# Altium project Pi-Zero_HUB.X4.PrjPcb
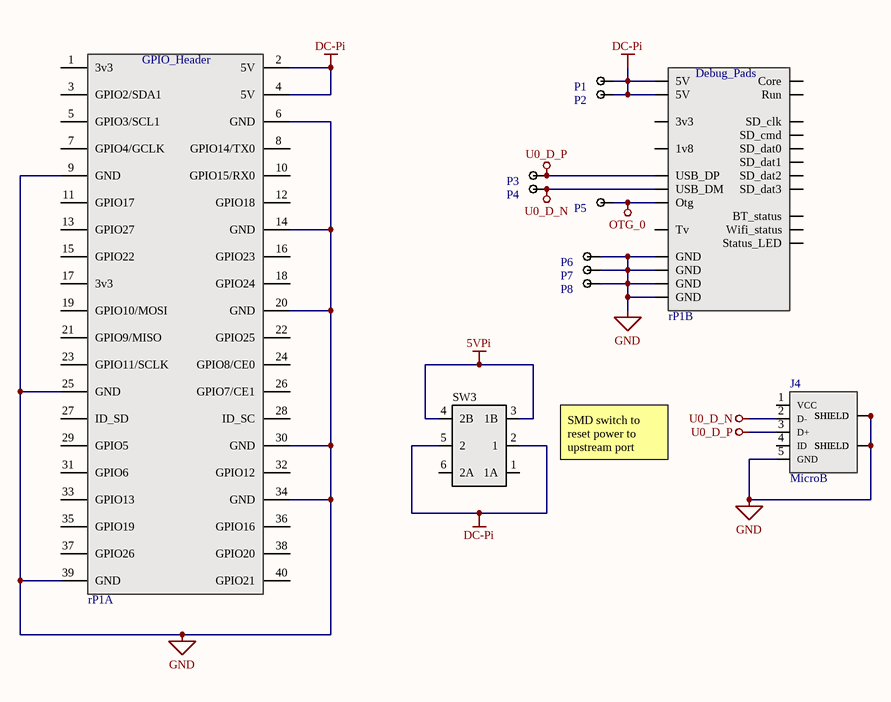
[diagram p0: RPi_Carrier.SchDoc]
4 sheets, 128 parts. Net scope: global (net labels, ports and power ports of the same name join across sheets).
Board file: Pi-Zero_HUB.PcbDoc
Sheets:
  RPi_Carrier.SchDoc
  Power Regulation.SchDoc
  USB Hub.SchDoc
  LAN_RJ45.SchDoc

## Sheet RPi_Carrier.SchDoc
size A; SPICEModelCacheFYOWLMMU: <root> / <DocumentId>FYOWLMMU</DocumentId> / </root>; SheetNumber: 1; SheetTotal: 4; CompanyName: Gamber-Johnson LLC; Organization: CD Cell

### Parts
J4  MicroB  [10118194-0001LF]
P1  MillMax Pogo  [0914-1-15-20-77-14-11-0]  (value not drawn)
P2  MillMax Pogo  [0914-1-15-20-77-14-11-0]  (value not drawn)
P3  MillMax Pogo  [0914-1-15-20-77-14-11-0]  (value not drawn)
P4  MillMax Pogo  [0914-1-15-20-77-14-11-0]  (value not drawn)
P5  MillMax Pogo  [0914-1-15-20-77-14-11-0]  (value not drawn)
P6  MillMax Pogo  [0914-1-15-20-77-14-11-0]  (value not drawn)
P7  MillMax Pogo  [0914-1-15-20-77-14-11-0]  (value not drawn)
P8  MillMax Pogo  [0914-1-15-20-77-14-11-0]  (value not drawn)
rP1  rPi Zero Carrier  [rPiZero]  (value not drawn)  (parts A,B of 2)
SW3  (no value)  [SMD-DPDT-SW]

### Nets
5VPi: SW3.3(1B) SW3.4(2B)
DC-Pi: P1.1 P2.1 rP1.2(5V) rP1.4(5V) rP1.5V1(5V) rP1.5V2(5V) SW3.2(1) SW3.5(2)
GND: J4.5(GND) J4.SH1(SHIELD) J4.SH2(SHIELD) J4.SH3(SHIELD) J4.SH4(SHIELD) J4.SH5(SHIELD) J4.SH6(SHIELD) P6.1 P7.1 P8.1 rP1.6(GND) rP1.9(GND) rP1.14(GND) rP1.20(GND) rP1.25(GND) rP1.30(GND) rP1.34(GND) rP1.39(GND) rP1.G1(GND) rP1.G2(GND) rP1.G3(GND) rP1.G4(GND)
OTG_0: P5.1 rP1.OTG(Otg)
U0_D_N: J4.2(D-) P4.1 rP1.USB_DM
U0_D_P: J4.3(D+) P3.1 rP1.USB_DP

Not connected (* = marked no-connect by the designer): J4 1(VCC) 4(ID); rP1 1(3v3) 1V8(1v8) 3(GPIO2/SDA1) 3V3(3v3) 5(GPIO3/SCL1) 7(GPIO4/GCLK) 8(GPIO14/TX0) 10(GPIO15/RX0) 11(GPIO17) 12(GPIO18) 13(GPIO27) 15(GPIO22) 16(GPIO23) 17(3v3) 18(GPIO24) 19(GPIO10/MOSI) 21(GPIO9/MISO) 22(GPIO25) 23(GPIO11/SCLK) 24(GPIO8/CE0) 26(GPIO7/CE1) 27(ID_SD) 28(ID_SC) 29(GPIO5) 31(GPIO6) 32(GPIO12) 33(GPIO13) 35(GPIO19) 36(GPIO16) 37(GPIO26) 38(GPIO20) 40(GPIO21) BT_ON(BT_status) CORE(Core) RUN(Run) SD_CLK(SD_clk) SD_CMD(SD_cmd) SD_DAT0(SD_dat0) SD_DAT1(SD_dat1) SD_DAT2(SD_dat2) SD_DAT3(SD_dat3) STATUS(Status_LED) TV(Tv) WL_ON(Wifi_status); SW3 1(1A) 6(2A)

### Notes on the sheet
- SMD switch to reset power to upstream port
- REV
- REVISIONS
- DATE
- DESCRIPTION
- BY
- UNLESS OTHERWISE SPECIFIED, DRAWING DEFINITIONS AND TOLERANCES SHALL BE FOUND UNDER SUPPLIER STANDARDS SS-001. THIS PART AND ALL COMPONENTS OF IT MUST BE RoHS & REACH COMPLIANT. A CERTIFICATE OF COMPLIANCE MUST BE PROVIDED UPON REQUEST.
- ALL INFORMATION ON THIS DOCUMENT IS THE SOLE PROPERTY OF GAMBER-JOHNSON AND SHALL NOT BE COPIED, REPRODUCED, USED OR DISCLOSED IN WHOLE OR IN PART WITHOUT THE WRITTEN CONSENT OF GAMBER-JOHNSON
- TOLERANCES
  .00 ± .060
  .000 ± .020
  .0000 ± .005
  ANGELS ± 1°
- DRAWN BY:
- PROJECT NUMBER:
- SHEET TITLE:
- SHEET
- OF
- DATE:
- LOCATION:
- ASSEMBLY NUMBER
- SIZE
- GAMBER-JOHNSON LLC
  5001 Joerns Dr
  STEVENS POINT, WI 54481
  +1 (715) 344-5209
- A
- (in symbol RP-Zero, part A) GPIO_Header
- (in symbol RP-Zero, part B) Debug_Pads

### Library data of the parts
J4 = 10118194-0001LF: Micro USB, Input Output Connectors, B TYPE RECEPTACLE with flange; MF: Amphenol ICC; SnapEDA_Link: https://www.snapeda.com/parts/10118194-0001LF/Amphenol+FCI/view-part/?ref=snap; Package: None; Value: *; MP: 10118194-0001LF; Check_prices: https://www.snapeda.com/parts/10118194-0001LF/Amphenol+FCI/view-part/?ref=eda; LCSC PN: C132563
P1-P8 = GenericPogo: MillMax Pogo Pins/Probes
rP1 = RP-Zero: Raspberry Pi Zero/W/2W / Header, debug-pads, & mounting
SW3 = MS-22D17-G2: Brick nogging DPDT Black SMD Slide Switch; LCSC PN: C2904912

## Sheet Power Regulation.SchDoc
size A; SheetNumber: 2; SheetTotal: 4
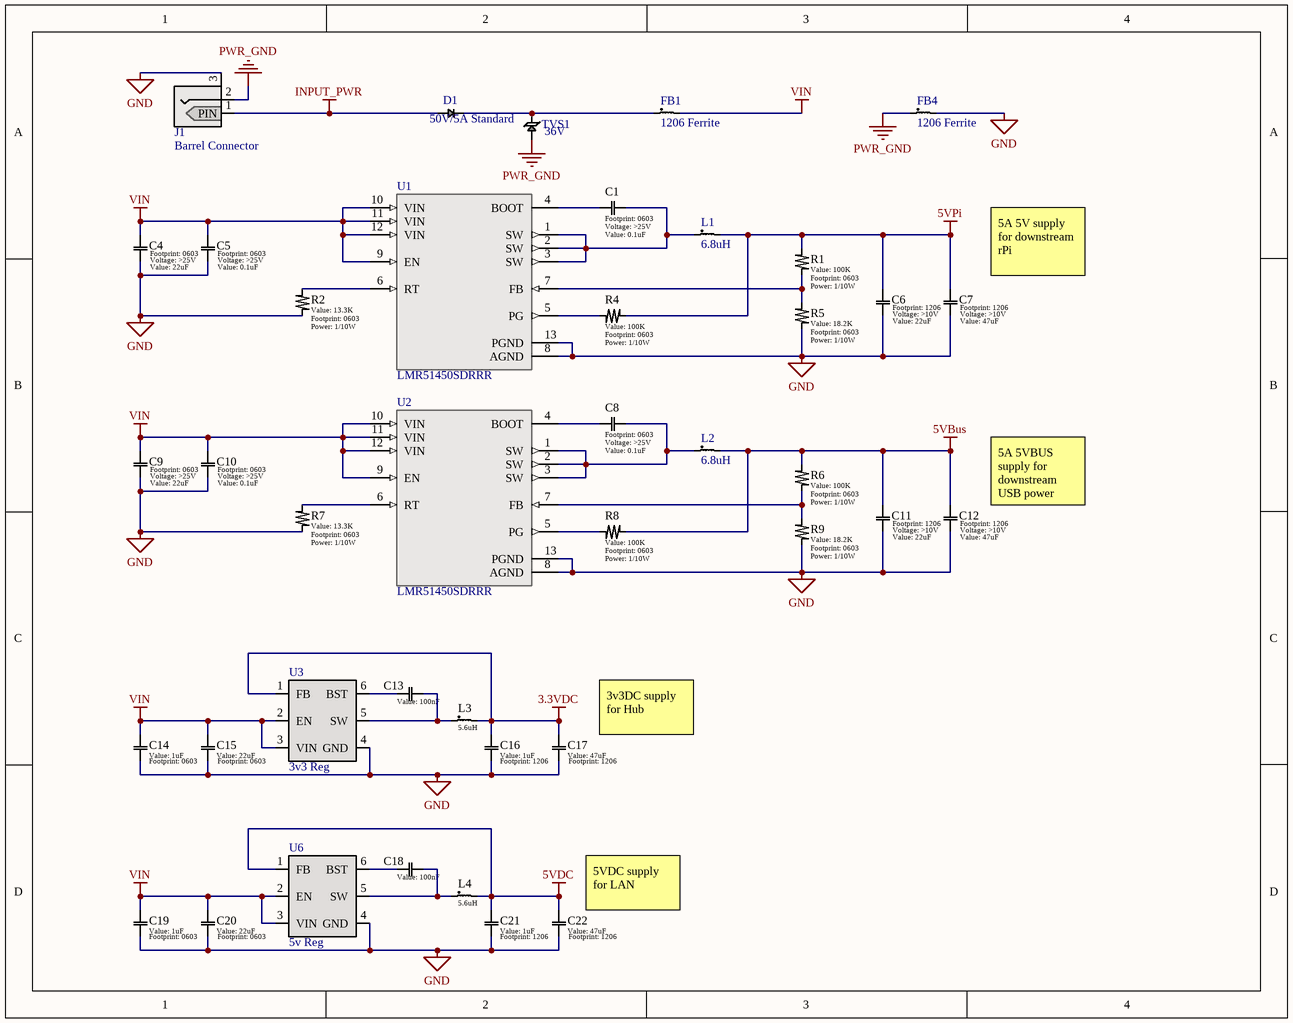
[diagram p1: Power Regulation.SchDoc]

### Parts
C1  value 0.1uF  Voltage: >25V  [0603]  (hidden comment: Generic Capacitor)
C4  value 22uF  Voltage: >25V  [0603]  (hidden comment: Generic Capacitor)
C5  value 0.1uF  Voltage: >25V  [0603]  (hidden comment: Generic Capacitor)
C6  value 22uF  Voltage: >10V  [1206]  (hidden comment: Generic Capacitor)
C7  value 47uF  Voltage: >10V  [1206]  (hidden comment: Generic Capacitor)
C8  value 0.1uF  Voltage: >25V  [0603]  (hidden comment: Generic Capacitor)
C9  value 22uF  Voltage: >25V  [0603]  (hidden comment: Generic Capacitor)
C10  value 0.1uF  Voltage: >25V  [0603]  (hidden comment: Generic Capacitor)
C11  value 22uF  Voltage: >10V  [1206]  (hidden comment: Generic Capacitor)
C12  value 47uF  Voltage: >10V  [1206]  (hidden comment: Generic Capacitor)
C13  value 100nF  [0603]  (hidden comment: Generic Capacitor)
C14  value 1uF  [0603]  (hidden comment: Generic Capacitor)
C15  value 22uF  [0603]  (hidden comment: Generic Capacitor)
C16  value 1uF  [1206]  (hidden comment: Generic Capacitor)
C17  value 47uF  [1206]  (hidden comment: Generic Capacitor)
C18  value 100nF  [0603]  (hidden comment: Generic Capacitor)
C19  value 1uF  [0603]  (hidden comment: Generic Capacitor)
C20  value 22uF  [0603]  (hidden comment: Generic Capacitor)
C21  value 1uF  [1206]  (hidden comment: Generic Capacitor)
C22  value 47uF  [1206]  (hidden comment: Generic Capacitor)
D1  50V/5A Standard  [DO-214AC]
FB1  1206 Ferrite  [1206]
FB4  1206 Ferrite  [1206]
J1  Barrel Connector  [PJ-082BH]
L1  6.8uH  [IHLP3232DZER6R8M11]
L2  6.8uH  [IHLP3232DZER6R8M11]
L3  5.6uH  [TMPC0402HP]
L4  5.6uH  [TMPC0402HP]
R1  value 100K  Power: 1/10W  [0603]  (hidden comment: Generic Resistor)
R2  value 13.3K  Power: 1/10W  [0603]  (hidden comment: Generic Resistor)
R4  value 100K  Power: 1/10W  [0603]  (hidden comment: Generic Resistor)
R5  value 18.2K  Power: 1/10W  [0603]  (hidden comment: Generic Resistor)
R6  value 100K  Power: 1/10W  [0603]  (hidden comment: Generic Resistor)
R7  value 13.3K  Power: 1/10W  [0603]  (hidden comment: Generic Resistor)
R8  value 100K  Power: 1/10W  [0603]  (hidden comment: Generic Resistor)
R9  value 18.2K  Power: 1/10W  [0603]  (hidden comment: Generic Resistor)
TVS1  36V  [DO-214AC]
U1  LMR51450SDRRR  [WSON-12]
U2  LMR51450SDRRR  [WSON-12]
U3  3v3 Reg  [TSOT-23-6]
U6  5v Reg  [TSOT-23-6]

### Nets
3.3VDC: C16.1 C17.1 L3.2 U3.1(FB)
5VBus: C11.1 C12.1 L2.2 R6.2 R8.1
5VDC: C21.1 C22.1 L4.2 U6.1(FB)
5VPi: C6.1 C7.1 L1.2 R1.2 R4.1
GND: C4.2 C5.2 C6.2 C7.2 C9.2 C10.2 C11.2 C12.2 C14.2 C15.2 C16.2 C17.2 C19.2 C20.2 C21.2 C22.2 FB4.2 J1.3(SHD_B) R2.1 R5.1 R7.1 R9.1 U1.8(AGND) U1.13(PGND) U2.8(AGND) U2.13(PGND) U3.4(GND) U6.4(GND)
INPUT_PWR: D1.2(Anode) J1.1(PIN)
PWR_GND: FB4.1 J1.2(SHD_A) TVS1.2(Anode)
VIN: C4.1 C5.1 C9.1 C10.1 C14.1 C15.1 C19.1 C20.1 FB1.2 U1.9(EN) U1.10(VIN) U1.11(VIN) U1.12(VIN) U2.9(EN) U2.10(VIN) U2.11(VIN) U2.12(VIN) U3.2(EN) U3.3(VIN) U6.2(EN) U6.3(VIN)
NetC1_1: C1.1 U1.4(BOOT)
NetC1_2: C1.2 L1.1 U1.1(SW) U1.2(SW) U1.3(SW)
NetC8_1: C8.1 U2.4(BOOT)
NetC8_2: C8.2 L2.1 U2.1(SW) U2.2(SW) U2.3(SW)
NetC13_1: C13.1 U3.6(BST)
NetC13_2: C13.2 L3.1 U3.5(SW)
NetC18_1: C18.1 U6.6(BST)
NetC18_2: C18.2 L4.1 U6.5(SW)
NetD1_1: D1.1(Cathode) FB1.1 TVS1.1(Cathode)
NetR1_1: R1.1 R5.2 U1.7(FB)
NetR2_2: R2.2 U1.6(RT)
NetR4_2: R4.2 U1.5(PG)
NetR6_1: R6.1 R9.2 U2.7(FB)
NetR7_2: R7.2 U2.6(RT)
NetR8_2: R8.2 U2.5(PG)

### Notes on the sheet
- (near C7) 5A 5V supply for downstream rPi
- (near C12) 5A 5VBUS supply for downstream USB power
- (near C17) 3v3DC supply for Hub
- (near C22) 5VDC supply for LAN
- REV
- REVISIONS
- DATE
- DESCRIPTION
- BY
- UNLESS OTHERWISE SPECIFIED, DRAWING DEFINITIONS AND TOLERANCES SHALL BE FOUND UNDER SUPPLIER STANDARDS SS-001. THIS PART AND ALL COMPONENTS OF IT MUST BE RoHS & REACH COMPLIANT. A CERTIFICATE OF COMPLIANCE MUST BE PROVIDED UPON REQUEST.
- ALL INFORMATION ON THIS DOCUMENT IS THE SOLE PROPERTY OF GAMBER-JOHNSON AND SHALL NOT BE COPIED, REPRODUCED, USED OR DISCLOSED IN WHOLE OR IN PART WITHOUT THE WRITTEN CONSENT OF GAMBER-JOHNSON
- TOLERANCES
  .00 ± .060
  .000 ± .020
  .0000 ± .005
  ANGELS ± 1°
- DRAWN BY:
- PROJECT NUMBER:
- SHEET TITLE:
- SHEET
- OF
- DATE:
- LOCATION:
- ASSEMBLY NUMBER
- SIZE
- GAMBER-JOHNSON LLC
  5001 Joerns Dr
  STEVENS POINT, WI 54481
  +1 (715) 344-5209
- A

### Library data of the parts
C1 C4 C5 C7-C10 C12 = Generic Capacitor: Tolerance: 10%
C6 C11 = Generic Capacitor: Tolerance: 20%
C13-C22 = Generic Capacitor: Voltage: >10V; Tolerance: 10%
D1 = SBRT5A50SA-13: Diode Super Barrier 50V 5A Surface Mount; Manufacturer 1: Diodes; Element Configuration: Single; Forward Voltage: 460mV; Max Forward Surge Current (Ifsm): 70A; Max Reverse Current: 45mA; Supplier 1: Digi-Key; Manufacturer Part Number 1: SBRT5A50SA-13; RoHS: Yes; Category: Rectifier Diodes; Stock 1: 218992; Pricing 1: 1=0.49000, 10=0.38200, 100=0.22900, 500=0.21200, 1000=0.14416, 2000=0.13271 (USD); Mount: Surface Mount; Case/Package: SMA; Weight: 0.002258oz; Min Operating Temperature: -55°C; Max Operating Temperature: 150°C; Packaging: Tape and Reel; Average Rectified Current: 5A; Max Repetitive Reverse Voltage (Vrrm): 50V; Package Quantity: 5000; Max Reverse Voltage (DC): 50V; Lead Free: Lead Free; RoHS Compliant: Yes; ComponentLink1URL: http://www.farnell.com/datasheets/2814462.pdf?src-supplier=Farnell; ComponentLink1Description: http://www.farnell.com/datasheets/2814462.pdf?src-supplier=Farnell; ComponentLink2URL: https://www.diodes.com/assets/Datasheets/SBRT5A50SA.pdf?src-supplier=Arrow+Electronics; ComponentLink2Description: https://www.diodes.com/assets/Datasheets/SBRT5A50SA.pdf?src-supplier=Arrow+Electronics; ComponentLink3URL: https://www.diodes.com/assets/Datasheets/SBRT5A50SA.pdf?src-supplier=Mouser; ComponentLink3Description: https://www.diodes.com/assets/Datasheets/SBRT5A50SA.pdf?src-supplier=Mouser; ComponentLink4URL: https://www.diodes.com/assets/Datasheets/SBRT5A50SA.pdf?src-supplier=Avnet+Europe; ComponentLink4Description: https://www.diodes.com/assets/Datasheets/SBRT5A50SA.pdf?src-supplier=Avnet+Europe; ComponentLink5URL: http://www.farnell.com/datasheets/2814462.pdf?src-supplier=Newark; ComponentLink5Description: http://www.farnell.com/datasheets/2814462.pdf?src-supplier=Newark; ComponentLink6URL: https://www.diodes.com/assets/Datasheets/SBRT5A50SA.pdf?src-supplier=Avnet; ComponentLink6Description: https://www.diodes.com/assets/Datasheets/SBRT5A50SA.pdf?src-supplier=Avnet; ComponentLink7URL: https://www.diodes.com/assets/Datasheets/SBRT5A50SA.pdf?src-supplier=Digi-Key; ComponentLink7Description: https://www.diodes.com/assets/Datasheets/SBRT5A50SA.pdf?src-supplier=Digi-Key; ComponentLink8URL: http://www.farnell.com/datasheets/2814462.pdf?src-supplier=Element14; ComponentLink8Description: http://www.farnell.com/datasheets/2814462.pdf?src-supplier=Element14; ComponentLink9URL: https://www.diodes.com/assets/Datasheets/SBRT5A50SA.pdf?src-supplier=Verical; ComponentLink9Description: https://www.diodes.com/assets/Datasheets/SBRT5A50SA.pdf?src-supplier=Verical; Supplier Part Number 1: SBRT5A50SA-13DICT-ND
FB1 FB4 = HI1206T161R-10: 160 Ohms @ 100MHz 1 Power, Signal Line Ferrite Bead 1206 (3216 Metric) 6A 18mOhm; Manufacturer 1: Laird Steward; DC Resistance (DCR): 18mR; Number of Lines: 1; Impedance: 160R; Supplier 1: Digi-Key; Manufacturer Part Number 1: HI1206T161R-10; RoHS: Yes; Category: Fixed Inductors; Stock 1: 250713; Pricing 1: 1=0.20000, 10=0.15600, 25=0.12920, 50=0.11140, 100=0.10020, 250=0.08464, 500=0.07572, 1000=0.06458 (USD); Mount: Surface Mount; Case/Package: 1206; Weight: 0.0136oz; Case Code (Metric): 3216; Case Code (Imperial): 1206; Core Material: Ferrite; Material: Ferrite; Min Operating Temperature: -40°C; Max Operating Temperature: 125°C; Package Quantity: 1; Packaging: Tape and Reel; Max Current Rating: 6A; Current Rating: 6A; Max DC Current: 6A; Termination: SMD/SMT; Frequency: 100MHz; Test Frequency: 100MHz; Length: 3.2mm; Height: 0.071inch; Width: 0.063inch; Depth: 1.8mm; Lead Free: Lead Free; REACH SVHC: Unknown; ComponentLink1URL: https://datasheet.ciiva.com/22622/1685743-22622771.pdf?src-supplier=Element14; ComponentLink1Description: https://datasheet.ciiva.com/22622/1685743-22622771.pdf?src-supplier=Element14; ComponentLink2URL: https://datasheet.ciiva.com/16714/70065439-16714326.pdf?src-supplier=Allied+Electronics; ComponentLink2Description: https://datasheet.ciiva.com/16714/70065439-16714326.pdf?src-supplier=Allied+Electronics; Supplier Part Number 1: 240-2411-1-ND; LCSC PN: C391193
J1 = PJ-082BH: CONN PWR JACK 2.5X5.5MM SOLDER; Manufacturer 1: CUI; Gender: Male; Shielding: Shielded; Current Rating: 10A; Number of Conductors: 2; Supplier 1: Digi-Key; Manufacturer Part Number 1: PJ-082BH; RoHS: Yes; Category: Connectors; Stock 1: 24371; Pricing 1: 1=1.69000, 10=1.53600, 25=1.44200, 50=1.37940, 100=1.31670 (USD); Mount: Through Hole; Color: Black; Contact Material: Brass; Housing Material: Nylon; Contact Plating: Silver; Housing Color: Black; Min Operating Temperature: -25°C; Max Operating Temperature: 85°C; Orientation: Horizontal; Connector Type: Jack; Termination: Solder; Lead Free: Lead Free; ComponentLink1URL: https://datasheet.ciiva.com/7368/pj-082bh-7368042.pdf?src-supplier=Digi-Key; ComponentLink1Description: https://datasheet.ciiva.com/7368/pj-082bh-7368042.pdf?src-supplier=Digi-Key; ComponentLink2URL: https://datasheet.ciiva.com/7368/pj-082bh-7368045.pdf?src-supplier=Digi-Key; ComponentLink2Description: https://datasheet.ciiva.com/7368/pj-082bh-7368045.pdf?src-supplier=Digi-Key; Supplier Part Number 1: CP-082BHCT-ND; LCSC PN: C3001296
L1 L2 = IHLP3232DZER6R8M11: FIXED IND 6.8UH 7A 33.4 MOHM SMD; Manufacturer 1: Vishay Dale; Core Material: Ferrite; Inductance Tolerance: 20%; Self Resonant Frequency: 13MHz; Shielding: Shielded; Saturation Current: 6.7A; DC Resistance (DCR): 33.4mR; Test Frequency: 100kHz; LCSC PN: C511015; Supplier 1: Digi-Key; Manufacturer Part Number 1: IHLP3232DZER6R8M11; RoHS: Yes; Category: Fixed Inductors; Stock 1: 9946; Pricing 1: 1=1.40000, 10=1.30000, 25=1.20000, 50=1.00000, 100=0.94000, 250=0.84000 (USD); Mount: Surface Mount; Case/Package: 3232; Number of Pins: 2; Min Operating Temperature: -55°C; Max Operating Temperature: 125°C; Package Quantity: 500; Packaging: Tape and Reel; Tolerance: 20%; Current Rating: 7A; Inductance: 6.8uH; Max DC Current: 6.7A; Termination: SMD/SMT; RMS Current (Irms): 7A; Series: IHLP-3232DZ-11; Rated Current-Max: 7A; Length: 0.34inch; Width: 8.18mm; Height: 4mm; Height - Seated (Max): 0.157inch; Depth: 8.26mm; Radiation Hardening: No; REACH SVHC: Unknown; Military Standard: Not; Lead Free: Lead Free; RoHS Compliant: Yes; ComponentLink1URL: https://datasheet.ciiva.com/5763/ihlp3232dz11-5763504.pdf?src-supplier=Farnell; ComponentLink1Description: https://datasheet.ciiva.com/5763/ihlp3232dz11-5763504.pdf?src-supplier=Farnell; ComponentLink2URL: https://datasheet.ciiva.com/1058/ihlp-3232dz-11-1058078.pdf?src-supplier=Digi-Key; ComponentLink2Description: https://datasheet.ciiva.com/1058/ihlp-3232dz-11-1058078.pdf?src-supplier=Digi-Key; ComponentLink3URL: https://datasheet.ciiva.com/1058/ihlp-3232dz-11-1058079.pdf?src-supplier=Digi-Key; ComponentLink3Description: https://datasheet.ciiva.com/1058/ihlp-3232dz-11-1058079.pdf?src-supplier=Digi-Key; ComponentLink4URL: https://datasheet.ciiva.com/1058/ihlp-3232dz-11-1058077.pdf?src-supplier=Digi-Key; ComponentLink4Description: https://datasheet.ciiva.com/1058/ihlp-3232dz-11-1058077.pdf?src-supplier=Digi-Key; ComponentLink5URL: https://datasheet.ciiva.com/8495/ihlp3232dz11-8495151.pdf?src-supplier=Avnet; ComponentLink5Description: https://datasheet.ciiva.com/8495/ihlp3232dz11-8495151.pdf?src-supplier=Avnet; ComponentLink6URL: https://datasheet.ciiva.com/8017/ihlp3232dz11-8017326.pdf?src-supplier=Element14; ComponentLink6Description: https://datasheet.ciiva.com/8017/ihlp3232dz11-8017326.pdf?src-supplier=Element14; Supplier Part Number 1: 541-1355-1-ND
L3 L4 = TMPC0402HP-5R6MG-Z02: 2A 5.6uH ±20% SMD Power Inductor; LCSC PN: C357137; Supplier 1: Digi-Key; Supplier Part Number 1: 732-3339-1-ND
R1 R2 R4-R9 = Generic Resistor: Tolerance: 1%
TVS1 = SMAJ36A: 58.1V Clamp 6.9A Ipp Tvs Diode Surface Mount DO-214AC (SMA); Manufacturer 1: Littelfuse; Peak Pulse Power: 400W; Polarity: Unidirectional; Breakdown Voltage: 40V; Test Current: 1mA; Number of Channels: 1; Leakage Current: 1uA; Max Power Dissipation: 3.3W; Power Line Protection: No; Max Breakdown Voltage: 44.2V; Supplier 1: Digi-Key; Manufacturer Part Number 1: SMAJ36A; RoHS: Yes; Category: TVS Diodes; Stock 1: 65200; Pricing 1: 1=0.41000, 10=0.27500, 100=0.15750, 500=0.11000, 1000=0.08750, 2000=0.08500 (USD); Mount: Surface Mount; Number of Pins: 2; Min Operating Temperature: -65°C; Max Operating Temperature: 150°C; Clamping Voltage: 58.1V; Packaging: Tape and Reel; Reverse Standoff Voltage: 36V; Peak Pulse Current: 6.9A; Max Surge Current: 6.9A; Package Quantity: 5000; Operating Supply Voltage: 36V; Reverse Breakdown Voltage: 40V; Min Breakdown Voltage: 40V; Number of Elements: 1; Termination: SMD/SMT; Direction: Unidirectional; Resistor Type: Zener; Number of Unidirectional Channels: 1; Voltage Rating (DC): 36V; Power Dissipation: 400W; Length: 5.28mm; Height: 2.29mm; Width: 2.79mm; Lead Free: Lead Free; REACH SVHC: No SVHC; ComponentLink1URL: https://datasheet.ciiva.com/330/littelfuse-tvs-diode-smaj-datasheet-pdf-330760.pdf?src-supplier=Digi-Key; ComponentLink1Description: https://datasheet.ciiva.com/330/littelfuse-tvs-diode-smaj-datasheet-pdf-330760.pdf?src-supplier=Digi-Key; ComponentLink2URL: https://datasheet.ciiva.com/330/littelfuse-tvs-diode-smaj-datasheet-pdf-330762.pdf?src-supplier=Digi-Key; ComponentLink2Description: https://datasheet.ciiva.com/330/littelfuse-tvs-diode-smaj-datasheet-pdf-330762.pdf?src-supplier=Digi-Key; ComponentLink3URL: https://datasheet.ciiva.com/28473/607617-28473423.pdf?src-supplier=Element14; ComponentLink3Description: https://datasheet.ciiva.com/28473/607617-28473423.pdf?src-supplier=Element14; ComponentLink4URL: https://datasheet.ciiva.com/330/littelfuse-tvs-diode-smaj-datasheet-pdf-330761.pdf?src-supplier=Digi-Key; ComponentLink4Description: https://datasheet.ciiva.com/330/littelfuse-tvs-diode-smaj-datasheet-pdf-330761.pdf?src-supplier=Digi-Key; ComponentLink5URL: https://datasheet.ciiva.com/16487/littelfuse-tvs-diode-smaj-16487437.pdf?src-supplier=Future+Electronics; ComponentLink5Description: https://datasheet.ciiva.com/16487/littelfuse-tvs-diode-smaj-16487437.pdf?src-supplier=Future+Electronics; Supplier Part Number 1: SMAJ36ALFCT-ND
U1 U2 = LMR51450SDRRR: 36-V, 5-A synchronous buck converter; MF: Texas Instruments; SnapEDA_Link: https://www.snapeda.com/parts/LMR51450SDRRR/Texas+Instruments/view-part/?ref=snap; Package: WSON-12 Texas Instruments; Value: *; MP: LMR51450SDRRR; Check_prices: https://www.snapeda.com/parts/LMR51450SDRRR/Texas+Instruments/view-part/?ref=eda; LCSC PN: C6890985
U3 = AP63203WU-7: Switching Voltage Regulators DCDC Conv HV Buck TSOT26 T&R 3K; Manufacturer_Name: Diodes Inc.; Geometry.Height: 1mm; Manufacturer_Part_Number: AP63203WU-7; Mouser Part Number: 621-AP63203WU-7; Mouser Price/Stock: https://www.mouser.co.uk/ProductDetail/Diodes-Incorporated/AP63203WU-7?qs=u16ybLDytRZ1JqxbuLkMJw%3D%3D; Arrow Part Number: AP63203WU-7; Arrow Price/Stock: https://www.arrow.com/en/products/ap63203wu-7/diodes-incorporated?region=asia; Datasheet Link: https://componentsearchengine.com/Datasheets/1/AP63203WU-7.pdf; LCSC PN: C780769
U6 = AP63205WU-7: Step-down type Fixed 2A 5V 3.8V~32V; Mfr_Name: Diodes Inc; Copyright: Copyright (C) 2023 Ultra Librarian. All rights reserved.; Manufacturer_Part_Number: AP63205WU-7; RefDes: RefDes; Type: DEV; LCSC PN: C2071056

## Sheet USB Hub.SchDoc
size A; SheetNumber: 3; SheetTotal: 4; CompanyName: Gamber-Johnson LLC; Organization: CD Cell
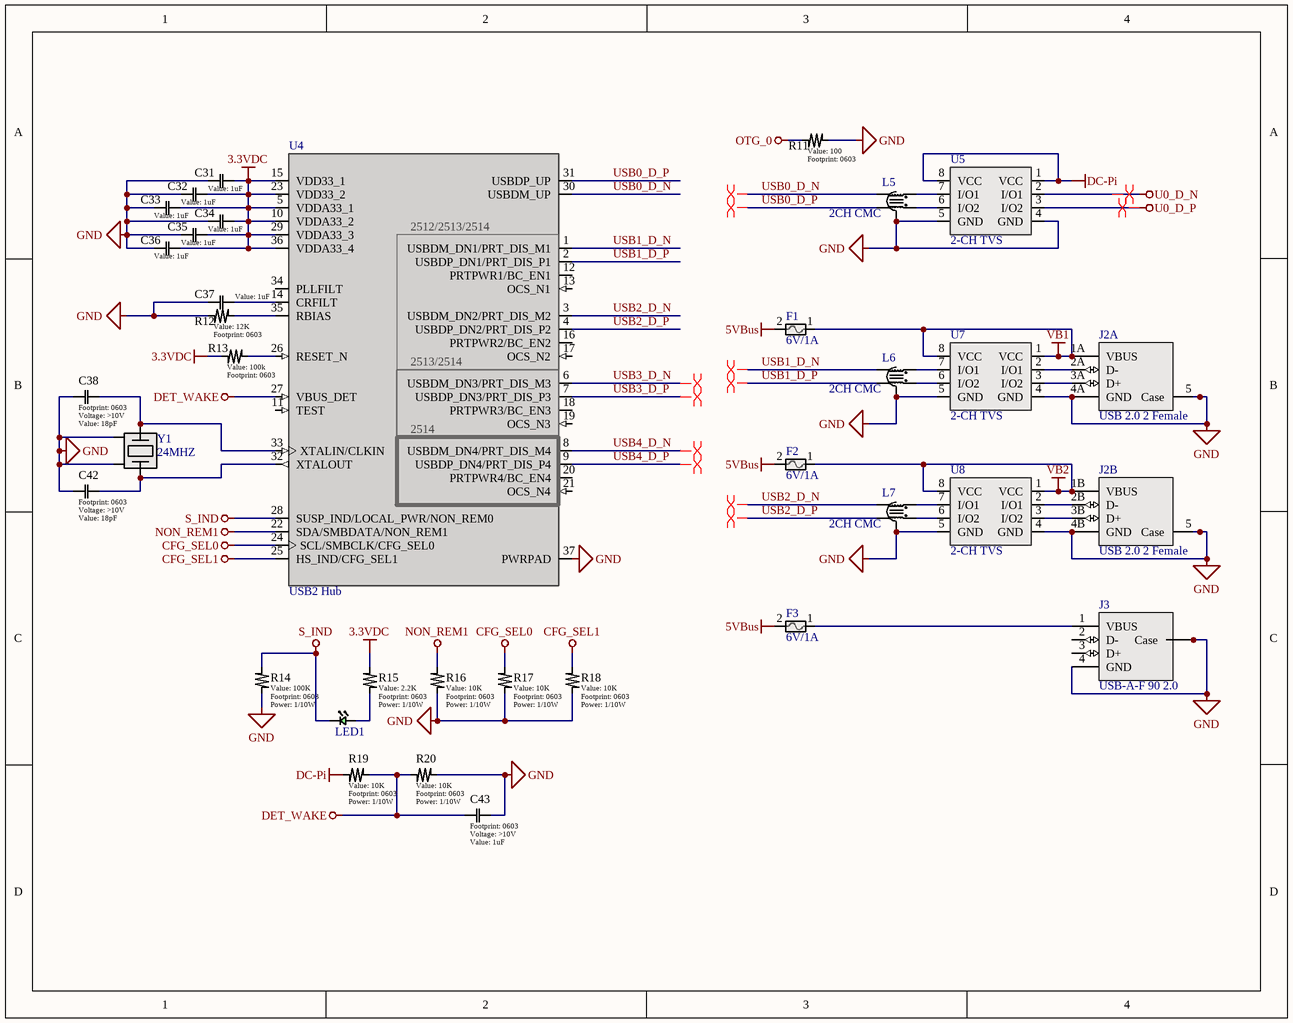
[diagram p2: USB Hub.SchDoc]

### Parts
C31  value 1uF  [0603]  (hidden comment: Generic Capacitor)
C32  value 1uF  [0603]  (hidden comment: Generic Capacitor)
C33  value 1uF  [0603]  (hidden comment: Generic Capacitor)
C34  value 1uF  [0603]  (hidden comment: Generic Capacitor)
C35  value 1uF  [0603]  (hidden comment: Generic Capacitor)
C36  value 1uF  [0603]  (hidden comment: Generic Capacitor)
C37  value 1uF  [0603]  (hidden comment: Generic Capacitor)
C38  value 18pF  Voltage: >10V  [0603]  (hidden comment: Generic Capacitor)
C42  value 18pF  Voltage: >10V  [0603]  (hidden comment: Generic Capacitor)
C43  value 1uF  Voltage: >10V  [0603]  (hidden comment: Generic Capacitor)
F1  6V/1A  [0805]
F2  6V/1A  [0805]
F3  6V/1A  [0805]
J2  USB 2.0 2 Female  [907-111A1022D10200]  (parts A,B of 2)
J3  USB-A-F 90 2.0  [Molex_67329-8000]
L5  2CH CMC  [SMD-6-2CH]
L6  2CH CMC  [SMD-6-2CH]
L7  2CH CMC  [SMD-6-2CH]
LED1  LTST-C191KGKT  [0603 (1608 Metric) Concave]  (value not drawn)
R11  value 100  [0603]  (hidden comment: Generic Resistor)
R12  value 12K  [0603]  (hidden comment: Generic Resistor)
R13  value 100k  [0603]  (hidden comment: Generic Resistor)
R14  value 100K  Power: 1/10W  [0603]  (hidden comment: Generic Resistor)
R15  value 2.2K  Power: 1/10W  [0603]  (hidden comment: Generic Resistor)
R16  value 10K  Power: 1/10W  [0603]  (hidden comment: Generic Resistor)
R17  value 10K  Power: 1/10W  [0603]  (hidden comment: Generic Resistor)
R18  value 10K  Power: 1/10W  [0603]  (hidden comment: Generic Resistor)
R19  value 10K  Power: 1/10W  [0603]  (hidden comment: Generic Resistor)
R20  value 10K  Power: 1/10W  [0603]  (hidden comment: Generic Resistor)
U4  USB2 Hub  [36-QFN (6x6)]
U5  2-CH TVS  [8-SOIC]
U7  2-CH TVS  [8-SOIC]
U8  2-CH TVS  [8-SOIC]
Y1  24MHZ  [SMD2520-4P]

### Nets
3.3VDC: C31.2 C32.2 C33.2 C34.2 C35.2 C36.2 R13.1 R15.1 U4.5(VDDA33_1) U4.10(VDDA33_2) U4.15(VDD33_1) U4.23(VDD33_2) U4.29(VDDA33_3) U4.36(VDDA33_4)
5VBus: F1.2 F2.2 F3.2
CFG_SEL0: R17.1 U4.24(SCL/SMBCLK/CFG_SEL0)
CFG_SEL1: R18.1 U4.25(HS_IND/CFG_SEL1)
DC-Pi: R19.1 U5.1(VCC) U5.8(VCC)
DET_WAKE: C43.1 R19.2 R20.1 U4.27(VBUS_DET)
GND: C31.1 C32.1 C33.1 C34.1 C35.1 C36.1 C37.1 C38.1 C42.1 C43.2 J2.4A(GND) J2.4B(GND) J2.5(Case) J3.4(GND) J3.5(Case) J3.6(Case) J3.7(Case) J3.8(Case) L5.5 L5.6 L6.5 L6.6 L7.5 L7.6 R11.2 R12.1 R14.2 R16.2 R17.2 R18.2 R20.2 U4.37(PWRPAD) U5.4(GND) U5.5(GND) U7.4(GND) U7.5(GND) U8.4(GND) U8.5(GND) Y1.2(GND) Y1.4(GND)
NON_REM1: R16.1 U4.22(SDA/SMBDATA/NON_REM1)
OTG_0: R11.1
S_IND: LED1.1(Cathode) R14.1 U4.28(SUSP_IND/LOCAL_PWR/NON_REM0)
U0_D_N: U5.2(I/O1)
U0_D_P: U5.3(I/O2)
VB1: F1.1 J2.1A(VBUS) U7.1(VCC) U7.8(VCC)
VB2: F2.1 J2.1B(VBUS) U8.1(VCC) U8.8(VCC)
USB0_D_N: L5.4 U4.30(USBDM_UP)
USB0_D_P: L5.3 U4.31(USBDP_UP)
USB1_D_N: L6.4 U4.1(USBDM_DN1/PRT_DIS_M1)
USB1_D_P: L6.3 U4.2(USBDP_DN1/PRT_DIS_P1)
USB2_D_N: L7.4 U4.3(USBDM_DN2/PRT_DIS_M2)
USB2_D_P: L7.3 U4.4(USBDP_DN2/PRT_DIS_P2)
USB3_D_N: U4.6(USBDM_DN3/PRT_DIS_M3)
USB3_D_P: U4.7(USBDP_DN3/PRT_DIS_P3)
USB4_D_N: U4.8(USBDM_DN4/PRT_DIS_M4)
USB4_D_P: U4.9(USBDP_DN4/PRT_DIS_P4)
NetC37_2: C37.2 U4.14(CRFILT)
NetC38_2: C38.2 U4.33(XTALIN/CLKIN) Y1.1
NetC42_2: C42.2 U4.32(XTALOUT) Y1.3
NetF3_1: F3.1 J3.1(VBUS)
NetJ2_2A: J2.2A(D-) U7.2(I/O1)
NetJ2_2B: J2.2B(D-) U8.2(I/O1)
NetJ2_3A: J2.3A(D+) U7.3(I/O2)
NetJ2_3B: J2.3B(D+) U8.3(I/O2)
NetL5_1: L5.1 U5.7(I/O1)
NetL5_2: L5.2 U5.6(I/O2)
NetL6_1: L6.1 U7.7(I/O1)
NetL6_2: L6.2 U7.6(I/O2)
NetL7_1: L7.1 U8.7(I/O1)
NetL7_2: L7.2 U8.6(I/O2)
NetLED1_2: LED1.2(Anode) R15.2
NetR12_2: R12.2 U4.35(RBIAS)
NetR13_2: R13.2 U4.26(RESET_N)

Not connected (* = marked no-connect by the designer): J3 2(D-) 3(D+); U4 11(TEST) 12(PRTPWR1/BC_EN1) 13(OCS_N1) 16(PRTPWR2/BC_EN2) 17(OCS_N2) 18(PRTPWR3/BC_EN3) 19(OCS_N3) 20(PRTPWR4/BC_EN4) 21(OCS_N4) 34(PLLFILT)

### Layout directives
differential pair: U0_D_N, U0_D_P, USB0_D_N, USB0_D_P, USB1_D_N, USB1_D_P, USB2_D_N, USB2_D_P, USB3_D_N, USB3_D_P, USB4_D_N, USB4_D_P

### Notes on the sheet
- REV
- REVISIONS
- DATE
- DESCRIPTION
- BY
- UNLESS OTHERWISE SPECIFIED, DRAWING DEFINITIONS AND TOLERANCES SHALL BE FOUND UNDER SUPPLIER STANDARDS SS-001. THIS PART AND ALL COMPONENTS OF IT MUST BE RoHS & REACH COMPLIANT. A CERTIFICATE OF COMPLIANCE MUST BE PROVIDED UPON REQUEST.
- ALL INFORMATION ON THIS DOCUMENT IS THE SOLE PROPERTY OF GAMBER-JOHNSON AND SHALL NOT BE COPIED, REPRODUCED, USED OR DISCLOSED IN WHOLE OR IN PART WITHOUT THE WRITTEN CONSENT OF GAMBER-JOHNSON
- TOLERANCES
  .00 ± .060
  .000 ± .020
  .0000 ± .005
  ANGELS ± 1°
- DRAWN BY:
- PROJECT NUMBER:
- SHEET TITLE:
- SHEET
- OF
- DATE:
- LOCATION:
- ASSEMBLY NUMBER
- SIZE
- GAMBER-JOHNSON LLC
  5001 Joerns Dr
  STEVENS POINT, WI 54481
  +1 (715) 344-5209
- A
- (in symbol USB251xBI-AEZG) 2512/2513/2514; 2513/2514; 2514

### Library data of the parts
C31-C37 = Generic Capacitor: Voltage: >10V; Tolerance: 10%
C38 C42 C43 = Generic Capacitor: Tolerance: 10%
F1-F3 = 0ZCK0100FF2E: Polymeric PTC Resettable Fuse 6V 1 A Ih Surface Mount 0805 (2012 Metric), Concave; Manufacturer: Bel; Max Current Rating: 40A; Hold Current: 1A; Trip Current: 1.95A; Time to Trip: 0.3s; Supplier 1: Digi-Key; Supplier Part Number 1: 507-1815-1-ND; Manufacturer Part Number: 0ZCK0100FF2E; RoHS: Yes; Category: PTC Resettable Fuses; Stock 1: 74738; Pricing 1: 1=0.27000, 5=0.26600, 10=0.25400, 50=0.22620, 100=0.21060, 250=0.18720, 500=0.15600, 1000=0.14820 (USD); Mount: Surface Mount; Case/Package: 0805; Case Code (Metric): 2012; Case Code (Imperial): 0805; Contact Plating: Tin,Matte; Min Operating Temperature: -40°C; Max Operating Temperature: 85°C; Package Quantity: 1; Packaging: Tape and Reel; RoHS Compliant: Yes; ComponentLink1URL: https://datasheet.ciiva.com/18550/0zck-18550620.pdf?src-supplier=Digi-Key; ComponentLink1Description: https://datasheet.ciiva.com/18550/0zck-18550620.pdf?src-supplier=Digi-Key; ComponentLink2URL: https://datasheet.ciiva.com/18550/0zck-18550621.pdf?src-supplier=Digi-Key; ComponentLink2Description: https://datasheet.ciiva.com/18550/0zck-18550621.pdf?src-supplier=Digi-Key; ComponentLink3URL: https://datasheet.ciiva.com/18550/0zck-18550622.pdf?src-supplier=Digi-Key; ComponentLink3Description: https://datasheet.ciiva.com/18550/0zck-18550622.pdf?src-supplier=Digi-Key
J2 = 907-111A1022D10200: USB 2.0 2 8 Female Type-A Plugin USB Connectors ROHS; LCSC PN: C12049
J3 = 673298000: USB 2.0 1 Side insertion 4P Female Type-A Plugin; LCSC PN: C588410
L5-L7 = ICMEF112P350MFR: 35Ω@100MHz -40℃~+85℃ 4Ω 5V 2 100mA SMD Common Mode Filters ROHS; LCSC PN: C396460; Supplier 1: Mouser; Supplier Part Number 1: 710-748020024
LED1 = CMP-013-000000-1: LED Uni-Color Green 574nm 2-Pin Chip LED T/R; Manufacturer 1: Vishay Lite-On; Number of Elements: 1; Viewing Angle: 130°; Lens Transparency: Clear; Power Dissipation: 75mW; Test Current: 20mA; Lens Style: Rectangular,Colorless; Reverse Voltage: 5V; Lens Color: Colorless; Forward Current: 30mA; Dominant Wavelength: 571nm; Forward Voltage: 2V; Luminous Intensity: 35mcd; Case Code (Imperial): 0603; Width: 0.8mm; Depth: 0.8mm; Case Code (Metric): 1608; Packaging: Tape and Reel; Number of LEDs: 1; Lead Free: Lead Free; Package Quantity: 1; Illumination Color: Green; Design Item ID: LTST-C191KGKT; Color: Green; Mount: Surface Mount; Source: Diodes.SchLib; Radiation Hardening: No; Wavelength: 574nm; RoHS: Yes; Max Power Dissipation: 75mW; RoHS Compliant: Yes; Power Rating: 75mW; Case/Package: 0603; Length: 1.6mm; Component Type: Standard; Number of Pins: 2; Height: 0.55mm; Stock 1: 4150; Pin Count: 2; ComponentLink1Description: https://datasheet.ciiva.com/2109/ltst-c191kgkt-2109973.pdf?src-supplier=Digi-Key; Manufacturer Part Number 1: LTST-C191KGKT; Category: LEDs; Min Operating Temperature: -55°C; ComponentLink1URL: https://datasheet.ciiva.com/2109/ltst-c191kgkt-2109973.pdf?src-supplier=Digi-Key; Max Operating Temperature: 85°C; Pricing 1: 50=0.14800, 250=0.06800, 500=0.06400, 1250=0.05400, 2500=0.05100 (USD)
R11-R13 = Generic Resistor: Tolerance: 1%; Power: 1/10W
R14-R20 = Generic Resistor: Tolerance: 1%
U4 = USB251xBI-AEZG: USB Hub Controller USB 2.0 USB Interface 36-QFN _6x6_; MF: Microchip; MP: USB2514BI-AEZG; Digi-Key_Purchase_URL: https://www.digikey.com/product-detail/en/microchip-technology/USB2514BI-AEZG/USB2514BI-AEZG-ND/2258528?utm_source=snapeda&utm_medium=aggregator&utm_campaign=symbol; Digi-Key_Part_Number: USB2514BI-AEZG-ND; Package: QFN-36 Microchip; SnapEDA_Link: https://www.snapeda.com/parts/USB2514BI-AEZG/Microchip/view-part/48397/?ref=snap; Value: *; LCSC PN: C16251
U5 U7 U8 = USB6B1RL: TVS DIODE 5.25VWM 8-SOIC; Mfr_Name: STMicroelectronics; RefDes: RefDes; Type: Type; Supplier 1: Future Electronics; Supplier Part Number 1: 5702279; LCSC PN: C10508
Y1 = CM4024M00020001: 24MHz 20pF ±10ppm ±30ppm SMD-2520-4P Crystals ROHS; LCSC PN: C7294628

## Sheet LAN_RJ45.SchDoc
size B; SheetNumber: 4; SheetTotal: 4
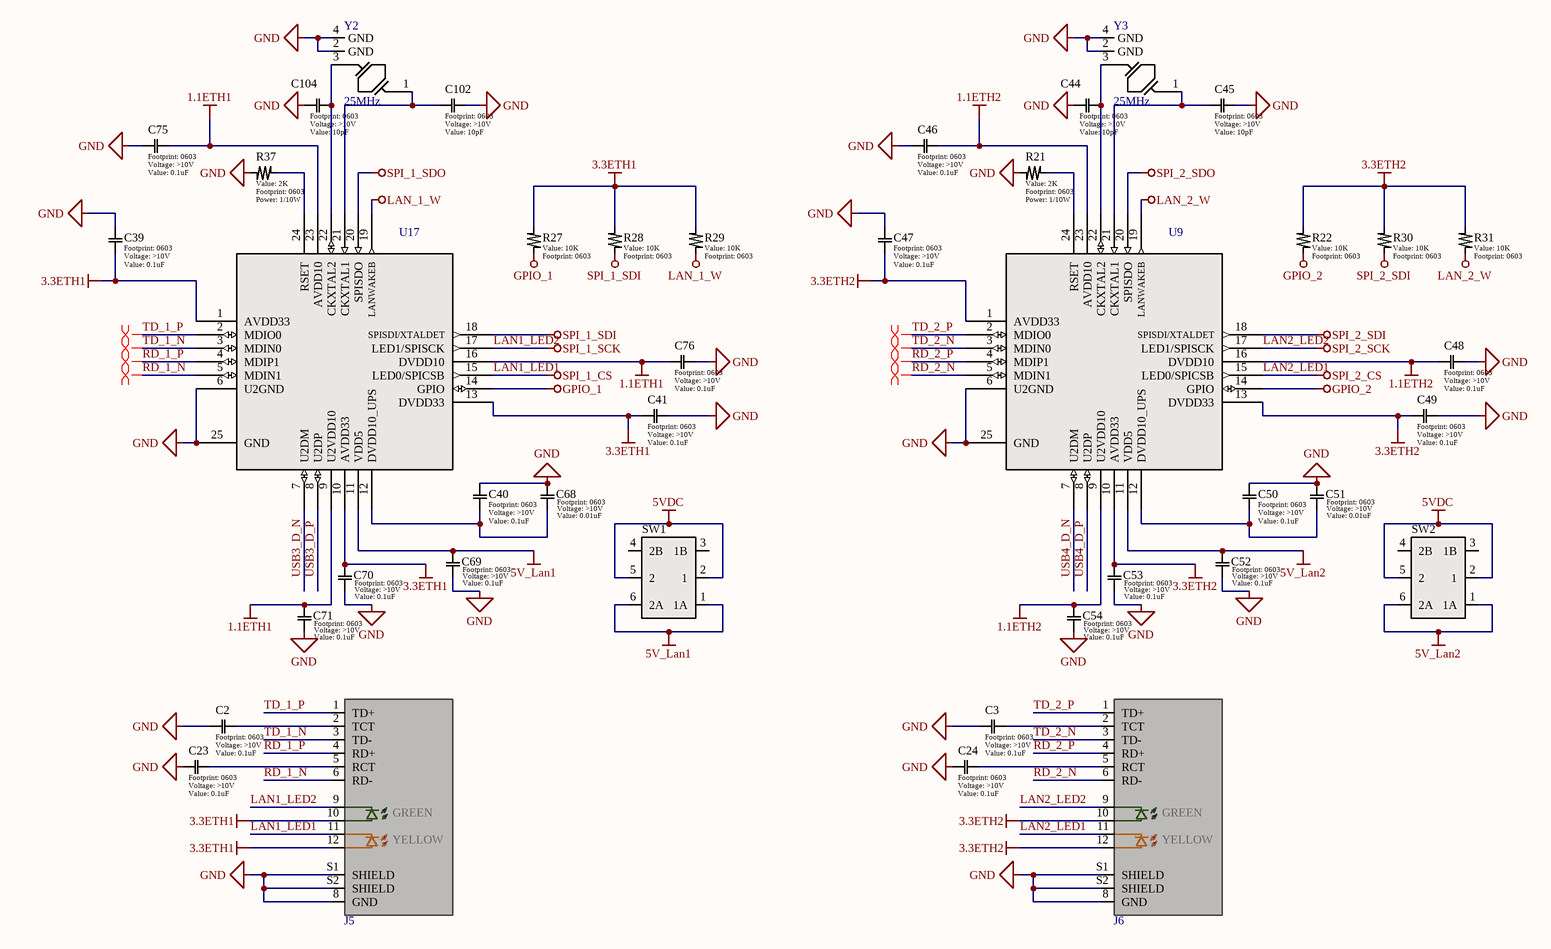
[diagram p3: LAN_RJ45.SchDoc]

### Parts
C2  value 0.1uF  Voltage: >10V  [0603]  (hidden comment: Generic Capacitor)
C3  value 0.1uF  Voltage: >10V  [0603]  (hidden comment: Generic Capacitor)
C23  value 0.1uF  Voltage: >10V  [0603]  (hidden comment: Generic Capacitor)
C24  value 0.1uF  Voltage: >10V  [0603]  (hidden comment: Generic Capacitor)
C39  value 0.1uF  Voltage: >10V  [0603]  (hidden comment: Generic Capacitor)
C40  value 0.1uF  Voltage: >10V  [0603]  (hidden comment: Generic Capacitor)
C41  value 0.1uF  Voltage: >10V  [0603]  (hidden comment: Generic Capacitor)
C44  value 10pF  Voltage: >10V  [0603]  (hidden comment: Generic Capacitor)
C45  value 10pF  Voltage: >10V  [0603]  (hidden comment: Generic Capacitor)
C46  value 0.1uF  Voltage: >10V  [0603]  (hidden comment: Generic Capacitor)
C47  value 0.1uF  Voltage: >10V  [0603]  (hidden comment: Generic Capacitor)
C48  value 0.1uF  Voltage: >10V  [0603]  (hidden comment: Generic Capacitor)
C49  value 0.1uF  Voltage: >10V  [0603]  (hidden comment: Generic Capacitor)
C50  value 0.1uF  Voltage: >10V  [0603]  (hidden comment: Generic Capacitor)
C51  value 0.01uF  Voltage: >10V  [0603]  (hidden comment: Generic Capacitor)
C52  value 0.1uF  Voltage: >10V  [0603]  (hidden comment: Generic Capacitor)
C53  value 0.1uF  Voltage: >10V  [0603]  (hidden comment: Generic Capacitor)
C54  value 0.1uF  Voltage: >10V  [0603]  (hidden comment: Generic Capacitor)
C68  value 0.01uF  Voltage: >10V  [0603]  (hidden comment: Generic Capacitor)
C69  value 0.1uF  Voltage: >10V  [0603]  (hidden comment: Generic Capacitor)
C70  value 0.1uF  Voltage: >10V  [0603]  (hidden comment: Generic Capacitor)
C71  value 0.1uF  Voltage: >10V  [0603]  (hidden comment: Generic Capacitor)
C75  value 0.1uF  Voltage: >10V  [0603]  (hidden comment: Generic Capacitor)
C76  value 0.1uF  Voltage: >10V  [0603]  (hidden comment: Generic Capacitor)
C102  value 10pF  Voltage: >10V  [0603]  (hidden comment: Generic Capacitor)
C104  value 10pF  Voltage: >10V  [0603]  (hidden comment: Generic Capacitor)
J5  V-RJ45-100  [BEL_SI-46001-F]  (value not drawn)
J6  V-RJ45-100  [BEL_SI-46001-F]  (value not drawn)
R21  value 2K  Power: 1/10W  [0603]  (hidden comment: Generic Resistor)
R22  value 10K  [0603]  (hidden comment: Generic Resistor)
R27  value 10K  [0603]  (hidden comment: Generic Resistor)
R28  value 10K  [0603]  (hidden comment: Generic Resistor)
R29  value 10K  [0603]  (hidden comment: Generic Resistor)
R30  value 10K  [0603]  (hidden comment: Generic Resistor)
R31  value 10K  [0603]  (hidden comment: Generic Resistor)
R37  value 2K  Power: 1/10W  [0603]  (hidden comment: Generic Resistor)
SW1  (no value)  [SMD-DPDT-SW]
SW2  (no value)  [SMD-DPDT-SW]
U9  10/100 USB LAN  [RTL8152B-VB-CG]  (value not drawn)
U17  10/100 USB LAN  [RTL8152B-VB-CG]  (value not drawn)
Y2  25MHz  [SMD3225-4P]
Y3  25MHz  [SMD3225-4P]

### Nets
1.1ETH1: C71.1 C75.1 C76.2 U17.9(U2VDD10) U17.16(DVDD10) U17.23(AVDD10)
1.1ETH2: C46.1 C48.2 C54.1 U9.9(U2VDD10) U9.16(DVDD10) U9.23(AVDD10)
3.3ETH1: C39.1 C41.2 C70.1 J5.10(GA) J5.12(YA) R27.1 R28.1 R29.1 U17.1(AVDD33) U17.10(AVDD33) U17.13(DVDD33)
3.3ETH2: C47.1 C49.2 C53.1 J6.10(GA) J6.12(YA) R22.1 R30.1 R31.1 U9.1(AVDD33) U9.10(AVDD33) U9.13(DVDD33)
5V_Lan1: C69.1 SW1.1(1A) SW1.6(2A) U17.11(VDD5)
5V_Lan2: C52.1 SW2.1(1A) SW2.6(2A) U9.11(VDD5)
5VDC: SW1.2(1) SW1.5(2) SW2.2(1) SW2.5(2)
GND: C2.1 C3.1 C23.1 C24.1 C39.2 C40.1 C41.1 C44.2 C45.1 C46.2 C47.2 C48.1 C49.1 C50.1 C51.1 C52.2 C53.2 C54.2 C68.1 C69.2 C70.2 C71.2 C75.2 C76.1 C102.1 C104.2 J5.8(GND) J5.S1(SHIELD) J5.S2(SHIELD) J6.8(GND) J6.S1(SHIELD) J6.S2(SHIELD) R21.1 R37.1 U9.6(U2GND) U9.25(GND) U17.6(U2GND) U17.25(GND) Y2.2(GND) Y2.4(GND) Y3.2(GND) Y3.4(GND)
GPIO_1: R27.2 U17.14(GPIO)
GPIO_2: R22.2 U9.14(GPIO)
LAN1_LED1: J5.11(YK) U17.15(LED0/SPICSB)  [also labelled SPI_1_CS]
LAN1_LED2: J5.9(GK) U17.17(LED1/SPISCK)  [also labelled SPI_1_SCK]
LAN2_LED1: J6.11(YK) U9.15(LED0/SPICSB)  [also labelled SPI_2_CS]
LAN2_LED2: J6.9(GK) U9.17(LED1/SPISCK)  [also labelled SPI_2_SCK]
LAN_1_W: R29.2 U17.19(LANWAKEB)
LAN_2_W: R31.2 U9.19(LANWAKEB)
SPI_1_SDI: R28.2 U17.18(SPISDI/XTALDET)
SPI_1_SDO: U17.20(SPISDO)
SPI_2_SDI: R30.2 U9.18(SPISDI/XTALDET)
SPI_2_SDO: U9.20(SPISDO)
RD_1_N: J5.6(RD-) U17.5(MDIN1)
RD_1_P: J5.4(RD+) U17.4(MDIP1)
RD_2_N: J6.6(RD-) U9.5(MDIN1)
RD_2_P: J6.4(RD+) U9.4(MDIP1)
TD_1_N: J5.3(TD-) U17.3(MDIN0)
TD_1_P: J5.1(TD+) U17.2(MDIO0)
TD_2_N: J6.3(TD-) U9.3(MDIN0)
TD_2_P: J6.1(TD+) U9.2(MDIO0)
USB3_D_N: U17.7(U2DM)
USB3_D_P: U17.8(U2DP)
USB4_D_N: U9.7(U2DM)
USB4_D_P: U9.8(U2DP)
NetC2_2: C2.2 J5.2(TCT)
NetC3_2: C3.2 J6.2(TCT)
NetC23_2: C23.2 J5.5(RCT)
NetC24_2: C24.2 J6.5(RCT)
NetC40_2: C40.2 C68.2 U17.12(DVDD10_UPS)
NetC44_1: C44.1 U9.22(CKXTAL2) Y3.3
NetC45_2: C45.2 U9.21(CKXTAL1) Y3.1
NetC50_2: C50.2 C51.2 U9.12(DVDD10_UPS)
NetC102_2: C102.2 U17.21(CKXTAL1) Y2.1
NetC104_1: C104.1 U17.22(CKXTAL2) Y2.3
NetR21_2: R21.2 U9.24(RSET)
NetR37_2: R37.2 U17.24(RSET)

Not connected (* = marked no-connect by the designer): SW1 3(1B) 4(2B); SW2 3(1B) 4(2B)

### Layout directives
differential pair: RD_1_N, RD_1_P, RD_2_N, RD_2_P, TD_1_N, TD_1_P, TD_2_N, TD_2_P

### Notes on the sheet
- REV
- REVISIONS
- DATE
- DESCRIPTION
- BY
- UNLESS OTHERWISE SPECIFIED, DRAWING DEFINITIONS AND TOLERANCES SHALL BE FOUND UNDER SUPPLIER STANDARDS SS-001. THIS PART AND ALL COMPONENTS OF IT MUST BE RoHS & REACH COMPLIANT. A CERTIFICATE OF COMPLIANCE MUST BE PROVIDED UPON REQUEST.
- ALL INFORMATION ON THIS DOCUMENT IS THE SOLE PROPERTY OF GAMBER-JOHNSON AND SHALL NOT BE COPIED, REPRODUCED, USED OR DISCLOSED IN WHOLE OR IN PART WITHOUT THE WRITTEN CONSENT OF GAMBER-JOHNSON
- TOLERANCES
  .00 ± .060
  .000 ± .020
  .0000 ± .005
  ANGELS ± 1°
- DRAWN BY:
- PROJECT NUMBER:
- SHEET TITLE:
- SHEET
- OF
- DATE:
- LOCATION:
- ASSEMBLY NUMBER
- SIZE
- GAMBER-JOHNSON LLC
  5001 JOERNS DR.
  STEVENS POINT, WI 54481
  +1 (715) 344-5209
- B
- (in symbol SI-46001-F) GREEN; YELLOW

### Library data of the parts
C2 C3 C23 C24 C39-C41 C44-C54 C68-C71 C75 C76 C102 C104 = Generic Capacitor: Tolerance: 10%
J5 J6 = SI-46001-F: Conn RJ-45 F 8 POS 2.54mm Solder ST Thru-Hole 12 Terminal 1 Port; MF: Bel Magnetic Solutions; DigiKey-Purchase-URL: https://snapeda.com/shop?store=DigiKey&id=4791083; Mouser-Purchase-URL: https://snapeda.com/shop?store=Mouser&id=4791083; Value: *; MP: SI-46001-F; Availability: Unavailable; Price: None; Package: None; SnapEDA_Link: https://www.snapeda.com/parts/SI-46001-F/Bel%20Magnetic%20Solutions/view-part/4791083/?ref=snap; LCSC PN: C2760326
R21 R37 = Generic Resistor: Tolerance: 1%
R22 R27-R31 = Generic Resistor: Tolerance: 1%; Power: 1/10W
SW1 SW2 = MS-22D17-G2: as SW3 on sheet RPi_Carrier; LCSC PN: C2904912
U9 U17 = RTL8152B-VB-CG: Ethernet Controllers 1V ~ 5.25V IEEE 802.3, USB 2.0, USB 1.1 MII, SPI, USB QFN-24_4x4x05P Ethernet ICs ROHS; LCSC PN: C50656
Y2 Y3 = ABM8G-25.000MHZ-B4Y-T: 25 MHz ±30ppm Crystal 10pF 60 Ohms 4-SMD, No Lead / SMD3225-4P; Manufacturer: Abracon; ESR (Equivalent Series Resistance): 60R; Supplier 1: Digi-Key; Supplier Part Number 1: 535-10297-1-ND; Manufacturer Part Number: ABM8G-25.000MHZ-B4Y-T; RoHS: Yes; Category: Crystals; Stock 1: 123; Pricing 1: 1=0.82000, 10=0.72900, 50=0.68120, 100=0.60190, 500=0.57024 (USD); Mount: Surface Mount; Case/Package: SMD/SMT; Number of Pins: 4; Min Operating Temperature: -20°C; Max Operating Temperature: 70°C; Packaging: Tape and Reel; Frequency Tolerance: 30ppm; Load Capacitance: 10pF; Frequency: 25MHz; Package Quantity: 1000; Tolerance: 30ppm; Frequency Stability: 30ppm; Termination: SMD/SMT; Series: ABM8G; Series Resistance: 60R; Operating Frequency: 25 MHz; Length: 3.2mm; Width: 0.098inch; Height: 0.039inch; Depth: 2.5mm; REACH SVHC: Unknown; Lead Free: Lead Free; ComponentLink1URL: https://datasheet.ciiva.com/855/abm8g-855228.pdf?src-supplier=Digi-Key; ComponentLink1Description: https://datasheet.ciiva.com/855/abm8g-855228.pdf?src-supplier=Digi-Key; ComponentLink2URL: https://datasheet.ciiva.com/855/abm8g-855229.pdf?src-supplier=Digi-Key; ComponentLink2Description: https://datasheet.ciiva.com/855/abm8g-855229.pdf?src-supplier=Digi-Key; ComponentLink3URL: https://datasheet.ciiva.com/855/abm8g-855230.pdf?src-supplier=Digi-Key; ComponentLink3Description: https://datasheet.ciiva.com/855/abm8g-855230.pdf?src-supplier=Digi-Key; ComponentLink4URL: https://datasheet.ciiva.com/4945/abm8g-10572-4945134.pdf?src-supplier=Mouser; ComponentLink4Description: https://datasheet.ciiva.com/4945/abm8g-10572-4945134.pdf?src-supplier=Mouser; ComponentLink5URL: https://datasheet.ciiva.com/7998/abm8g-7998635.pdf?src-supplier=Element14; ComponentLink5Description: https://datasheet.ciiva.com/7998/abm8g-7998635.pdf?src-supplier=Element14; ComponentLink6URL: https://datasheet.ciiva.com/28508/1883677-28508586.pdf?src-supplier=Element14; ComponentLink6Description: https://datasheet.ciiva.com/28508/1883677-28508586.pdf?src-supplier=Element14; ComponentLink7URL: https://datasheet.ciiva.com/16416/abm8g-16416874.pdf?src-supplier=Future+Electronics; ComponentLink7Description: https://datasheet.ciiva.com/16416/abm8g-16416874.pdf?src-supplier=Future+Electronics; LCSC PN: C9006

## Nets that join several sheets
3.3VDC: Power Regulation (C16.1 C17.1 L3.2 U3.1), USB Hub (14 pins)
5VBus: Power Regulation (5 pins), USB Hub (F1.2 F2.2 F3.2)
5VDC: Power Regulation (C21.1 C22.1 L4.2 U6.1), LAN_RJ45 (SW1.2 SW1.5 SW2.2 SW2.5)
5VPi: RPi_Carrier (SW3.3 SW3.4), Power Regulation (5 pins)
DC-Pi: RPi_Carrier (8 pins), USB Hub (R19.1 U5.1 U5.8)
GND: RPi_Carrier (22 pins), Power Regulation (28 pins), USB Hub (40 pins), LAN_RJ45 (42 pins)
OTG_0: RPi_Carrier (P5.1 rP1.OTG), USB Hub (R11.1)
U0_D_N: RPi_Carrier (J4.2 P4.1 rP1.USB_DM), USB Hub (U5.2)
U0_D_P: RPi_Carrier (J4.3 P3.1 rP1.USB_DP), USB Hub (U5.3)
USB3_D_N: USB Hub (U4.6), LAN_RJ45 (U17.7)
USB3_D_P: USB Hub (U4.7), LAN_RJ45 (U17.8)
USB4_D_N: USB Hub (U4.8), LAN_RJ45 (U9.7)
USB4_D_P: USB Hub (U4.9), LAN_RJ45 (U9.8)